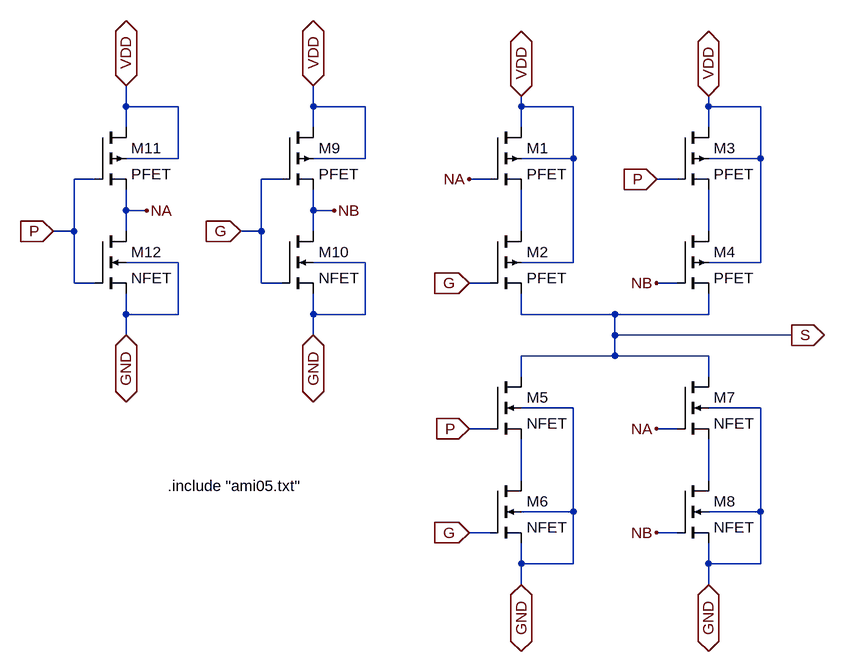
[diagram p0: schematic sum.asc]
sum.asc, the LTspice schematic file:
Version 4
SHEET 1 1584 680
WIRE -464 -240 -464 -272
WIRE -384 -240 -464 -240
WIRE -176 -240 -176 -272
WIRE -96 -240 -176 -240
WIRE 144 -240 144 -256
WIRE 224 -240 144 -240
WIRE 432 -240 432 -256
WIRE 512 -240 432 -240
WIRE -464 -208 -464 -240
WIRE -176 -208 -176 -240
WIRE 144 -208 144 -240
WIRE 432 -208 432 -240
WIRE -384 -160 -384 -240
WIRE -384 -160 -464 -160
WIRE -96 -160 -96 -240
WIRE -96 -160 -176 -160
WIRE 224 -160 224 -240
WIRE 224 -160 144 -160
WIRE 512 -160 512 -240
WIRE 512 -160 432 -160
WIRE -512 -128 -544 -128
WIRE -224 -128 -256 -128
WIRE 96 -128 64 -128
WIRE 384 -128 352 -128
WIRE -464 -80 -464 -112
WIRE -432 -80 -464 -80
WIRE -176 -80 -176 -112
WIRE -144 -80 -176 -80
WIRE -544 -48 -544 -128
WIRE -544 -48 -576 -48
WIRE -464 -48 -464 -80
WIRE -256 -48 -256 -128
WIRE -256 -48 -288 -48
WIRE -176 -48 -176 -80
WIRE 144 -48 144 -112
WIRE 432 -48 432 -112
WIRE -384 0 -464 0
WIRE -96 0 -176 0
WIRE 224 0 224 -160
WIRE 224 0 144 0
WIRE 512 0 512 -160
WIRE 512 0 432 0
WIRE -544 32 -544 -48
WIRE -512 32 -544 32
WIRE -256 32 -256 -48
WIRE -224 32 -256 32
WIRE 96 32 64 32
WIRE 384 32 352 32
WIRE -464 80 -464 48
WIRE -384 80 -384 0
WIRE -384 80 -464 80
WIRE -176 80 -176 48
WIRE -96 80 -96 0
WIRE -96 80 -176 80
WIRE 144 80 144 48
WIRE 288 80 144 80
WIRE 432 80 432 48
WIRE 432 80 288 80
WIRE -464 112 -464 80
WIRE -176 112 -176 80
WIRE 288 112 288 80
WIRE 560 112 288 112
WIRE 288 144 288 112
WIRE 288 144 144 144
WIRE 432 144 288 144
WIRE 144 176 144 144
WIRE 432 176 432 144
WIRE 224 224 144 224
WIRE 512 224 432 224
WIRE 96 256 64 256
WIRE 384 256 352 256
WIRE 144 336 144 272
WIRE 432 336 432 272
WIRE 224 384 224 224
WIRE 224 384 144 384
WIRE 512 384 512 224
WIRE 512 384 432 384
WIRE 96 416 64 416
WIRE 384 416 352 416
WIRE 144 464 144 432
WIRE 224 464 224 384
WIRE 224 464 144 464
WIRE 432 464 432 432
WIRE 512 464 512 384
WIRE 512 464 432 464
WIRE 144 496 144 464
WIRE 432 496 432 464
FLAG 144 -256 VDD
IOPIN 144 -256 BiDir
FLAG 432 -256 VDD
IOPIN 432 -256 BiDir
FLAG 64 -128 NA
FLAG 352 256 NA
FLAG 64 32 G
IOPIN 64 32 In
FLAG 64 416 G
IOPIN 64 416 In
FLAG 352 -128 P
IOPIN 352 -128 In
FLAG 352 32 NB
FLAG 352 416 NB
FLAG 64 256 P
IOPIN 64 256 In
FLAG 144 496 GND
IOPIN 144 496 BiDir
FLAG 432 496 GND
IOPIN 432 496 BiDir
FLAG 560 112 S
IOPIN 560 112 Out
FLAG -176 -272 VDD
IOPIN -176 -272 BiDir
FLAG -176 112 GND
IOPIN -176 112 BiDir
FLAG -144 -80 NB
FLAG -288 -48 G
IOPIN -288 -48 In
FLAG -464 -272 VDD
IOPIN -464 -272 BiDir
FLAG -464 112 GND
IOPIN -464 112 BiDir
FLAG -432 -80 NA
FLAG -576 -48 P
IOPIN -576 -48 In
SYMBOL pmos4 96 -208 R0
SYMATTR InstName M1
SYMATTR Value PFET
SYMATTR Value2 l=0.6u w=6u
SYMBOL pmos4 96 -48 R0
SYMATTR InstName M2
SYMATTR Value PFET
SYMATTR Value2 l=0.6u w=6u
SYMBOL pmos4 384 -208 R0
SYMATTR InstName M3
SYMATTR Value PFET
SYMATTR Value2 l=0.6u w=6u
SYMBOL pmos4 384 -48 R0
SYMATTR InstName M4
SYMATTR Value PFET
SYMATTR Value2 l=0.6u w=6u
SYMBOL nmos4 96 176 R0
SYMATTR InstName M5
SYMATTR Value NFET
SYMATTR Value2 l=0.6u w=3u
SYMBOL nmos4 96 336 R0
SYMATTR InstName M6
SYMATTR Value NFET
SYMATTR Value2 l=0.6u w=3u
SYMBOL nmos4 384 176 R0
SYMATTR InstName M7
SYMATTR Value NFET
SYMATTR Value2 l=0.6u w=3u
SYMBOL nmos4 384 336 R0
SYMATTR InstName M8
SYMATTR Value NFET
SYMATTR Value2 l=0.6u w=3u
SYMBOL pmos4 -224 -208 R0
SYMATTR InstName M9
SYMATTR Value PFET
SYMATTR Value2 l=0.6u w=3u
SYMBOL nmos4 -224 -48 R0
SYMATTR InstName M10
SYMATTR Value NFET
SYMATTR Value2 l=0.6u w=1.5u
SYMBOL pmos4 -512 -208 R0
SYMATTR InstName M11
SYMATTR Value PFET
SYMATTR Value2 l=0.6u w=3u
SYMBOL nmos4 -512 -48 R0
SYMATTR InstName M12
SYMATTR Value NFET
SYMATTR Value2 l=0.6u w=1.5u
TEXT -400 344 Left 2 !.include "ami05.txt"

The netlist it stands for:
* sum.asc
M1 VDD NA N001 VDD PFET l=0.6u w=6u
M2 N001 G S VDD PFET l=0.6u w=6u
M3 VDD P N002 VDD PFET l=0.6u w=6u
M4 N002 NB S VDD PFET l=0.6u w=6u
M5 S P N003 GND NFET l=0.6u w=3u
M6 N003 G GND GND NFET l=0.6u w=3u
M7 S NA N004 GND NFET l=0.6u w=3u
M8 N004 NB GND GND NFET l=0.6u w=3u
M9 VDD G NB VDD PFET l=0.6u w=3u
M10 NB G GND GND NFET l=0.6u w=1.5u
M11 VDD P NA VDD PFET l=0.6u w=3u
M12 NA P GND GND NFET l=0.6u w=1.5u
.model NMOS NMOS
.model PMOS PMOS
.lib standard.mos
.include "ami05.txt"
.backanno
.end